# Altium schematic sheet IMD.SchDoc
size A4; DocumentNumber: 2; SheetNumber: 2; SheetTotal: 5
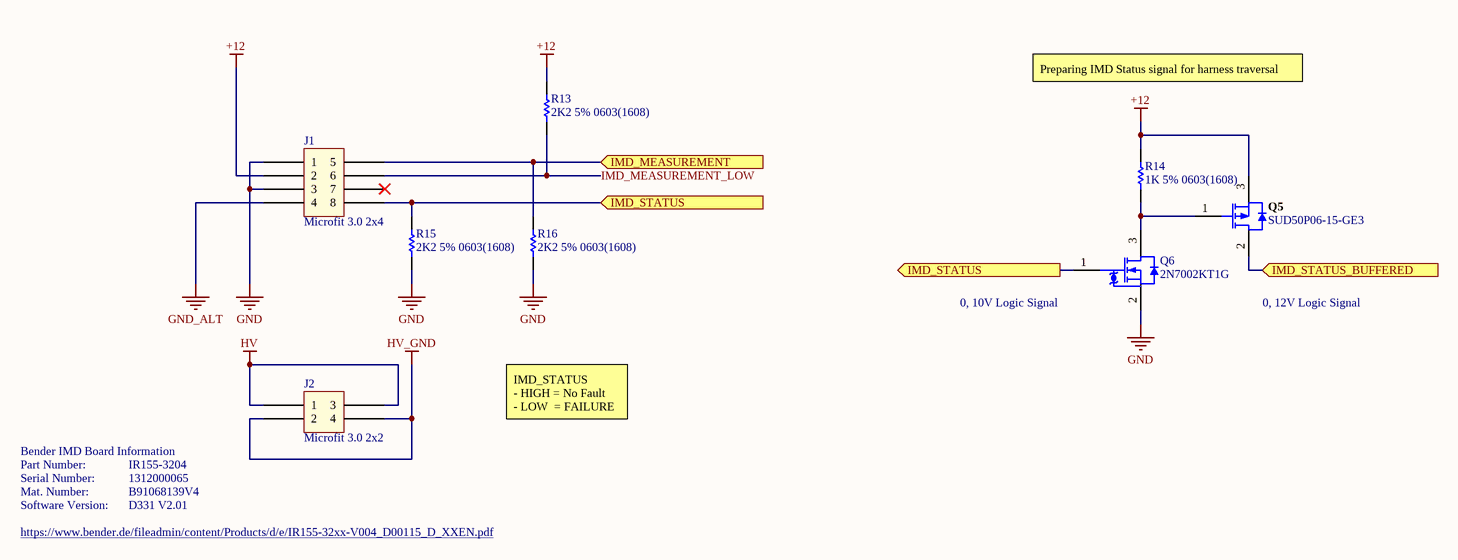
[diagram p0: IMD.SchDoc]

## Parts
J1  Microfit 3.0 2x4  [Microfit_2X4_R_TH]
J2  Microfit 3.0 2x2  [Microfit_2X2_R_TH]
Q5  SUD50P06-15-GE3  [VSIL-TO-252AA-3_V]
Q6  2N7002KT1G  [ONSC-SOT-23-3-318-08_V]
R13  2K2 5% 0603(1608)  [RESC0603(1608)_N]
R14  1K 5% 0603(1608)  [RESC0603(1608)_L]
R15  2K2 5% 0603(1608)  [RESC0603(1608)_N]
R16  2K2 5% 0603(1608)  [RESC0603(1608)_N]

## Ports
IMD_MEASUREMENT (in), IMD_STATUS (in), IMD_STATUS (out), IMD_STATUS_BUFFERED (in)

## Nets
+12: J1.2 Q5.3(S) R13.2 R14.2
GND: J1.1 J1.3 Q6.2(S) R15.1 R16.1
GND_ALT: J1.4
HV: J2.1 J2.3
HV_GND: J2.2 J2.4
IMD_MEASUREMENT: J1.5 R16.2 ; port IMD_MEASUREMENT
IMD_MEASUREMENT_LOW: J1.6 R13.1
IMD_STATUS: J1.8 Q6.1(G) R15.2 ; port IMD_STATUS
IMD_STATUS_BUFFERED: Q5.2(D) ; port IMD_STATUS_BUFFERED
NetQ5_1: Q5.1(G) Q6.3(D) R14.1

Not connected (* = marked no-connect by the designer): J1 7*

## Notes on the sheet
- Preparing IMD Status signal for harness traversal
- (near Q6) 0, 10V Logic Signal
- 0, 12V Logic Signal
- IMD_STATUS
  - HIGH = No Fault
  - LOW  = FAILURE
- Bender IMD Board Information
- Part Number:
- Serial Number:
- IR155-3204
- 1312000065
- https://www.bender.de/fileadmin/content/Products/d/e/IR155-32xx-V004_D00115_D_XXEN.pdf
- Mat. Number:
- Software Version:
- B91068139V4
- D331 V2.01
- Title
- Size:
- Date:
- A4
- Number:
- Time:
- Revision:
- Sheet
- of
- File:

## Library data of the parts
J1 = Microfit_2x4
J2 = Microfit_2x2
Q5 = CMP-2000-05431-1: P-Channel (D-S) MOSFET, 30 V, -55 to 150 degC, 3-Pin TO-252, RoHS, Tape and Reel; Manufacturer: Vishay; Unit Weight: 0.050717oz; Id - Continuous Drain Current: 50A; Rise Time: 70ns; Fall Time: 175ns; Configuration: Single; Rds On - Drain-Source Resistance: 15mOhms; Transistor Type: 1P-Channel; Channel Mode: Enhancement; Number of Channels: 1Channel; Typical Turn-On Delay Time: 15ns; Brand: VishaySemiconductors; Pd - Power Dissipation: 2.5W; Vds - Drain-Source Breakdown Voltage: -60V; Vgs - Gate-Source Voltage: 20V; Mounting Style: SMD/SMT; Package / Case: TO-252AA-3; Height: 2.39mm; Datasheet Version: Rev. C, 07/2013; Factory Pack Quantity: 2000; RoHS: True; Typical Turn-Off Delay Time: 175ns; Minimum Operating Temperature: -55C; Tradename: TrenchFET; Manufacturer URL: http://www.vishay.com/; Package Description: 3-Pin Surface Mount Device, Body 6.54 x 6.095 mm, Pitch 2.28 mm; Package Reference: TO-252; Transistor Polarity: P-Channel; Technology: Si; Series: SUD; Datasheet URL: https://datasheet.ciiva.com/4444/sud50p06-244530-4444327.pdf; Width: 6.22mm; Product Category: MOSFET; Packaging: Reel; Length: 6.73mm; Package URL: http://www.vishay.com/docs/89975/v15wl45c-m3.pdf; Maximum Operating Temperature: +150C
Q6 = CMP-1058-00766-1: Small Signal MOSFET, 60 V, 380 mA, Single, N-Channel, 3-Pin SOT-23, Pb-Free, Tape and Reel; Manufacturer: On Semiconductor; Crss Typ (pF): 2.2; ID Max (A): 0.38; VGS(th) Max (V): 2.3; V(BR)DSS Min (V): 60; Coss Typ (pF): 4.2; Ciss Typ (pF): 24.5; Channel Polarity: N Channel; VGS Max (V): 20; RoHS: Pb-Free; PackageDescription: 3-Pin Small Outline Transistor, Body 2.92 x 1.3 mm, Pitch 0.95 mm; PackageVersion: Rev. AP, 11/2009; ComponentLink3URL: http://www.onsemi.cn/pub_link/Collateral/318-08.PDF; DatasheetVersion: Rev. 11; ComponentLink1URL: http://www.onsemi.com/; Configuration: Single; PackageReference: SOT-23-3-318-08; Mounting Technology: Surface Mount; Package Type: SOT-23-3; PartNumber: 2N7002KT1G; ComponentLink2Description: Datasheet; Packing: Tape and Reel; ComponentLink3Description: Package Specification; ComponentLink2URL: http://www.onsemi.com/pub_link/Collateral/2N7002K-D.PDF; ComponentLink1Description: Manufacturer URL
R13 R15 R16 = CMP-1012-00082-1: 2K2 0.1W 5% 0603 (1608 Metric)  SMD; Case-Metric: 1608; Value: 2200.00 Ohm; Case-EIA: 0603; Power: 0.1 W; Tolerance: 5 %; Technology: SMT
R14 = CMP-1012-00074-1: 1K 0.1W 5% 0603 (1608 Metric)  SMD; Case-EIA: 0603; Case-Metric: 1608; Value: 1000.00 Ohm; Technology: SMT; Tolerance: 5 %; Power: 0.1 W